# Altium schematic sheet Esquematico_2022-08-20.schdoc
size 297 x 182 mm
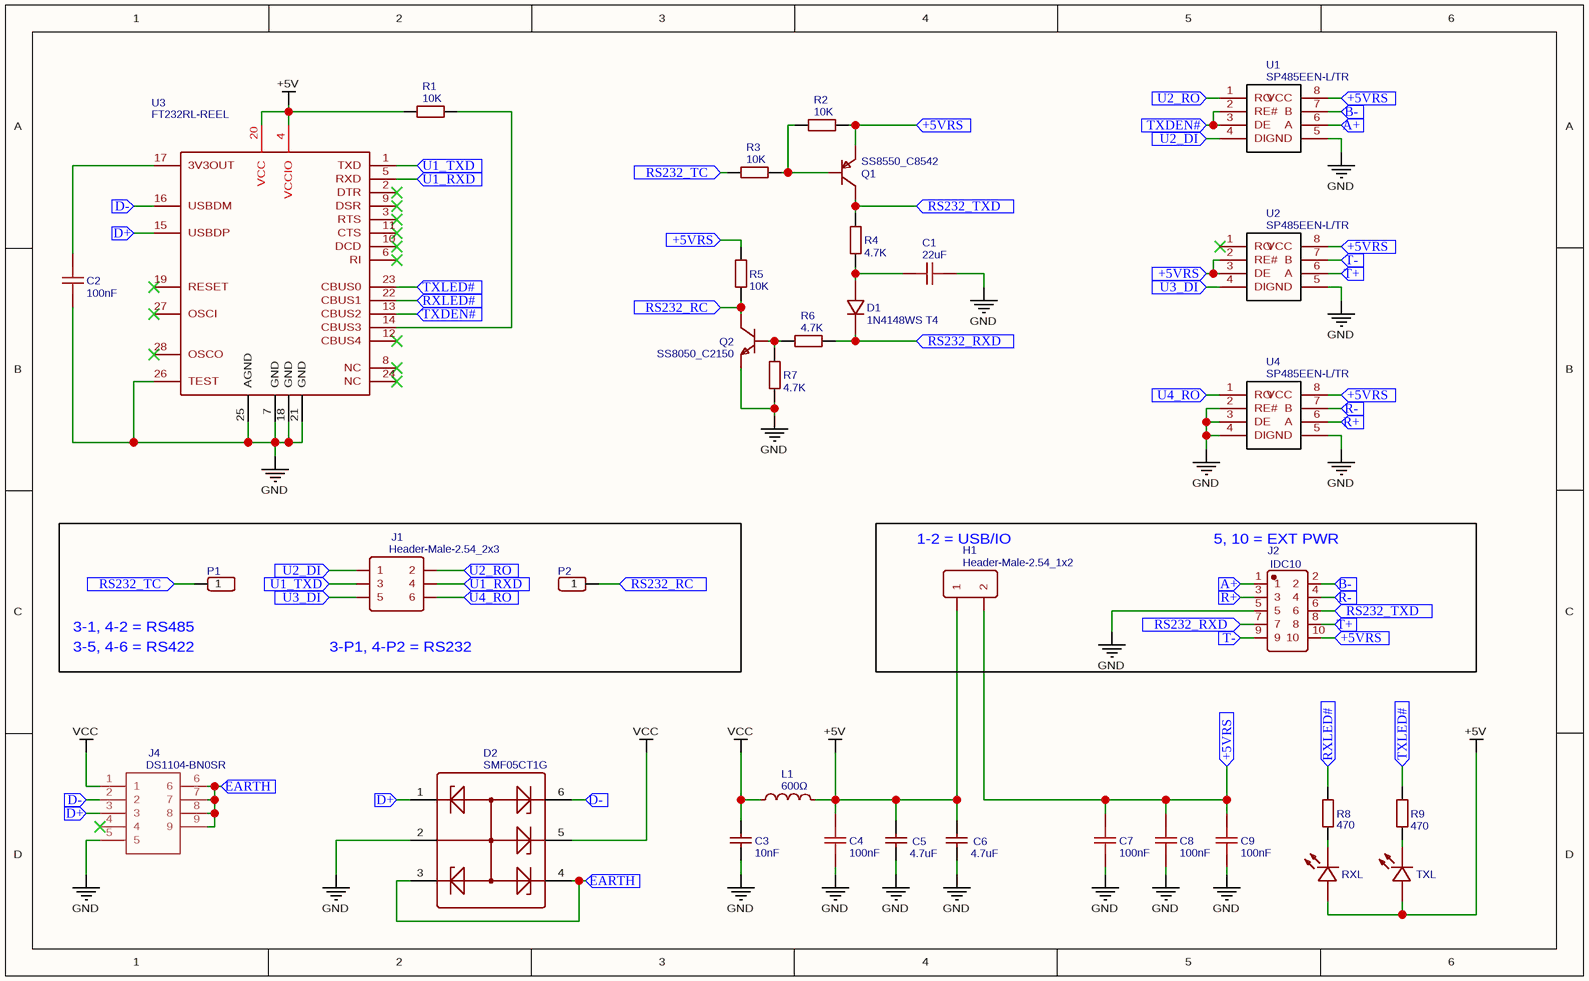
[diagram p0: Esquematico_2022-08-20.schdoc]

## Parts
C1  22uF  [C0805]
C2  100nF  [C0603]
C3  10nF  [C0603]
C4  100nF  [C0603]
C5  4.7uF  [C0603]
C6  4.7uF  [C0603]
C7  100nF  [C0603]
C8  100nF  [C0603]
C9  100nF  [C0603]
D1  1N4148WS T4  [SOD-323_L1.8-W1.3-LS2.5-RD]
D2  SMF05CT1G  [SOT-363_L2.0-W1.3-P0.65-LS2.1-TL]
H1  Header-Male-2.54_1x2  [HDR-TH_2P-P2.54-V]
J1  Header-Male-2.54_2x3  [HDR-TH_6P-P2.54-V-R2-C3-S2.54]
J2  IDC10  [IDC-TH_10P-P2.54-V-R2-C5-S2.54]
J4  DS1104-BN0SR  [DS1104BN0SR]
L1  600Ω  [L0805]
P1  Header-Male-2.54_1x1  [HDR-TH_1P-P2.54-V-M]  (value not drawn)
P2  Header-Male-2.54_1x1  [HDR-TH_1P-P2.54-V-M]  (value not drawn)
Q1  SS8550_C8542  [SOT-23-3_L2.9-W1.3-P1.90-LS2.4-BR]
Q2  SS8050_C2150  [SOT-23-3_L2.9-W1.3-P1.90-LS2.4-BR]
R1  10K  [R0603]
R2  10K  [R0603]
R3  10K  [R0603]
R4  4.7K  [R0603]
R5  10K  [R0603]
R6  4.7K  [R0603]
R7  4.7K  [R0603]
R8  470  [R0603]
R9  470  [R0603]
RXL  RXL  [LED0603-R-RD]  (value not drawn)
TXL  TXL  [LED0603-R-RD]  (value not drawn)
U1  SP485EEN-L/TR  [SOIC-8_L5.0-W4.0-P1.27-LS6.0-BL]
U2  SP485EEN-L/TR  [SOIC-8_L5.0-W4.0-P1.27-LS6.0-BL]
U3  FT232RL-REEL  [SSOP-28_L10.2-W5.3-P0.65-LS7.8-BL]
U4  SP485EEN-L/TR  [SOIC-8_L5.0-W4.0-P1.27-LS6.0-BL]

## Ports
+5VRS (in), A+ (in), B- (in), D+ (in), D- (in), EARTH (in), R+ (in), R- (in), RS232_RC (in), RS232_RXD (in), RS232_TC (in), RS232_TXD (in), RXLED# (in), T+ (in), T- (in), TXDEN# (in), TXLED# (in), U1_RXD (in), U1_TXD (in), U2_DI (in), U2_RO (in), U3_DI (in), U4_RO (in)

## Nets
+5V: C4.2 C5.2 C6.2 H1.1 L1.2 R1.1 RXL.1(A) TXL.1(A) U3.4(VCCIO) U3.20(VCC)
GND: C1.2 C2.1 C3.1 C4.1 C5.1 C6.1 C7.1 C8.1 C9.1 D2.2 J2.5 J4.5 Q2.2(E) R7.2 U1.5(GND) U2.5(GND) U3.7(GND) U3.18(GND) U3.21(GND) U3.25(AGND) U3.26(TEST) U4.2(RE#) U4.3(DE) U4.4(DI) U4.5(GND)
VCC: C3.2 D2.5 J4.1 L1.1
+5VRS: C7.2 C8.2 C9.2 H1.2 J2.10 Q1.2(E) R2.2 R5.2 U1.8(VCC) U2.2(RE#) U2.3(DE) U2.8(VCC) U4.8(VCC) ; port +5VRS
A+: J2.1 U1.6(A) ; port A+
B-: J2.2 U1.7(B) ; port B-
D+: D2.1 J4.3 U3.15(USBDP) ; port D+
D-: D2.6 J4.2 U3.16(USBDM) ; port D-
EARTH: D2.3 D2.4 J4.6 J4.7 J4.8 J4.9 ; port EARTH
R+: J2.3 U4.6(A) ; port R+
R-: J2.4 U4.7(B) ; port R-
RS232_RC: P2.1 Q2.3(C) R5.1 ; port RS232_RC
RS232_RXD: D1.1(K) J2.7 R6.1 ; port RS232_RXD
RS232_TC: P1.1 R3.1 ; port RS232_TC
RS232_TXD: J2.6 Q1.3(C) R4.2 ; port RS232_TXD
RXLED#: R8.2 U3.22(CBUS1) ; port RXLED#
T+: J2.8 U2.6(A) ; port T+
T-: J2.9 U2.7(B) ; port T-
TXDEN#: U1.2(RE#) U1.3(DE) U3.13(CBUS2) ; port TXDEN#
TXLED#: R9.1 U3.23(CBUS0) ; port TXLED#
U1_RXD: J1.4 U3.5(RXD) ; port U1_RXD
U1_TXD: J1.3 U3.1(TXD) ; port U1_TXD
U2_DI: J1.1 U1.4(DI) ; port U2_DI
U2_RO: J1.2 U1.1(RO) ; port U2_RO
U3_DI: J1.5 U2.4(DI) ; port U3_DI
U4_RO: J1.6 U4.1(RO) ; port U4_RO
NetC1_1: C1.1 D1.2(A) R4.1
NetC2_2: C2.2 U3.17(3V3OUT)
NetQ1_1: Q1.1(B) R2.1 R3.2
NetQ2_1: Q2.1(B) R6.2 R7.1
NetR1_2: R1.2 U3.14(CBUS3)
NetR8_1: R8.1 RXL.2(K)
NetR9_2: R9.2 TXL.2(K)

Not connected (* = marked no-connect by the designer): J4 4*; U2 1(RO)*; U3 2(DTR)* 3(RTS)* 6(RI)* 8(NC)* 9(DSR)* 10(DCD)* 11(CTS)* 12(CBUS4)* 19(RESET)* 24(NC)* 27(OSCI)* 28(OSCO)*

## Notes on the sheet
- (near H1) 1-2 = USB/IO
- (near J2) 5, 10 = EXT PWR
- (near P1) 3-1, 4-2 = RS485
- 3-5, 4-6 = RS422
- (near J1) 3-P1, 4-P2 = RS232

## Library data of the parts
C1 = 22uF: BOM_Manufacturer: SAMSUNG; BOM_Manufacturer Part: CL21A226MAQNNNE; nameAlias: Capacitance; SMT Type: Basic; BOM_Supplier: LCSC; BOM_Supplier Part: C45783; BOM_JLCPCB SMD: Yes; BOM_LCSC Assembly: Yes; spicePre: C; spiceSymbolName: CL21A226MAQNNNE
C2 C4 C7-C9 = 100nF: BOM_Manufacturer: YAGEO; BOM_Manufacturer Part: CC0603KRX7R9BB104; nameAlias: Capacitance; SMT Type: Basic; BOM_Supplier: LCSC; BOM_Supplier Part: C14663; BOM_JLCPCB SMD: Yes; BOM_LCSC Assembly: Yes; spicePre: C; spiceSymbolName: CC0603KRX7R9BB104
C3 = 10nF: BOM_Manufacturer: FH; BOM_Manufacturer Part: 0603B103K500NT; nameAlias: Capacitance; SMT Type: Basic; BOM_Supplier: LCSC; BOM_Supplier Part: C57112; BOM_JLCPCB SMD: Yes; BOM_LCSC Assembly: Yes; spicePre: C; spiceSymbolName: 0603B103K500NT
C5 C6 = 4.7uF: BOM_Manufacturer Part: CL10A475KO8NNNC; BOM_Manufacturer: SAMSUNG; nameAlias: Capacitance; SMT Type: Basic; BOM_Supplier: LCSC; BOM_Supplier Part: C19666; BOM_JLCPCB SMD: Yes; BOM_LCSC Assembly: Yes; spicePre: C; spiceSymbolName: CL10A475KO8NNNC
D1 = 1N4148WS T4: BOM_Manufacturer: CJ; SMT Type: Basic; BOM_Supplier: LCSC; BOM_Manufacturer Part: 1N4148WS T4; image: //image.lceda.cn/szlcsc/C2128.jpg; BOM_Supplier Part: C2128; BOM_JLCPCB SMD: Yes; BOM_LCSC Assembly: Yes; spicePre: D; spiceSymbolName: 1N4148WS T4
D2 = SMF05CT1G: BOM_Manufacturer: ON; SMT Type: Basic; BOM_Supplier: LCSC; BOM_Manufacturer Part: SMF05CT1G; image: //image.lceda.cn/szlcsc/C15879.jpg; BOM_Supplier Part: C15879; BOM_JLCPCB SMD: Yes; BOM_LCSC Assembly: Yes; spicePre: D; spiceSymbolName: SMF05CT1G
H1 = Header-Male-2.54_1x2: BOM_Manufacturer: TE Connectivity; BOM_Manufacturer Part: 826629-2; SMT Type: Extend; Package Display: No; BOM_Supplier: LCSC; image: //image.lceda.cn/szlcsc/C86471.jpg; BOM_Supplier Part: C86471; BOM_LCSC Assembly: Yes; spicePre: H; spiceSymbolName: Header-Male-2.54_1x2
J1 = Header-Male-2.54_2x3: BOM_Manufacturer: BOOMELE; SMT Type: Extend; Package Display: No; BOM_Supplier: LCSC; BOM_Manufacturer Part: Header-Male-2.54_2x3; BOM_Supplier Part: C65114; BOM_LCSC Assembly: Yes; spicePre: J; spiceSymbolName: Header-Male-2.54_2x3
J2 = IDC10: Contributor: romanlee; Package Display: No; spicePre: I; spiceSymbolName: IDC10
J4 = DS1104-BN0SR: Contributor: kutsiarda; Package Display: No; spicePre: J; spiceSymbolName: DS1104-BN0SR
L1 = 600Ω: BOM_Manufacturer: Sunlord; BOM_Manufacturer Part: GZ2012D601TF; nameAlias: Value; SMT Type: Basic; BOM_Supplier: LCSC; BOM_Supplier Part: C1017; BOM_JLCPCB SMD: Yes; BOM_LCSC Assembly: Yes; spicePre: L; spiceSymbolName: GZ2012D601TF
P1 P2 = Header-Male-2.54_1x1: BOM_Manufacturer: ReliaPro; SMT Type: Extend; Package Display: No; BOM_Supplier: LCSC; BOM_Manufacturer Part: Header-Male-2.54_1x1; BOM_Supplier Part: C81276; BOM_LCSC Assembly: Yes; spicePre: P; spiceSymbolName: Header-Male-2.54_1x1
Q1 = SS8550_C8542: BOM_Manufacturer: CJ; BOM_Manufacturer Part: SS8550; SMT Type: Basic; BOM_Supplier: LCSC; image: //image.lceda.cn/szlcsc/C8542.jpg; BOM_Supplier Part: C8542; BOM_JLCPCB SMD: Yes; BOM_LCSC Assembly: Yes; spicePre: Q; spiceSymbolName: SS8550_C8542
Q2 = SS8050_C2150: BOM_Manufacturer: CJ; BOM_Manufacturer Part: SS8050; SMT Type: Basic; BOM_Supplier: LCSC; image: //image.lceda.cn/szlcsc/C2150.jpg; BOM_Supplier Part: C2150; BOM_JLCPCB SMD: Yes; BOM_LCSC Assembly: Yes; spicePre: Q; spiceSymbolName: SS8050_C2150
R1-R3 R5 = 10K: BOM_Manufacturer: UniOhm; BOM_Manufacturer Part: 0603WAF1002T5E; nameAlias: Resistance (Ohms); SMT Type: Basic; BOM_Supplier: LCSC; BOM_Supplier Part: C25804; BOM_JLCPCB SMD: Yes; BOM_LCSC Assembly: Yes; spicePre: R; spiceSymbolName: 0603WAF1002T5E
R4 R6 R7 = 4.7K: BOM_Manufacturer: UniOhm; BOM_Manufacturer Part: 0603WAF4701T5E; nameAlias: Resistance (Ohms); SMT Type: Basic; BOM_Supplier: LCSC; BOM_Supplier Part: C23162; BOM_JLCPCB SMD: Yes; BOM_LCSC Assembly: Yes; spicePre: R; spiceSymbolName: 0603WAF4701T5E
R8 R9 = 470: BOM_Manufacturer: UniOhm; BOM_Manufacturer Part: 0603WAF4700T5E; nameAlias: Resistance (Ohms); SMT Type: Basic; BOM_Supplier: LCSC; BOM_Supplier Part: C23179; BOM_JLCPCB SMD: Yes; BOM_LCSC Assembly: Yes; spicePre: R; spiceSymbolName: 0603WAF4700T5E
RXL = RXL: BOM_Manufacturer: KENTO; BOM_Manufacturer Part: 0603White light; SMT Type: Basic; Package Display: No; BOM_Supplier: LCSC; image: //image.lceda.cn/szlcsc/C2290.jpg; BOM_Supplier Part: C2290; BOM_JLCPCB SMD: Yes; BOM_LCSC Assembly: Yes; spicePre: L; spiceSymbolName: 0603White light_C2290
TXL = TXL: BOM_Manufacturer: KENTO; BOM_Manufacturer Part: KT-0603R; SMT Type: Basic; Package Display: No; BOM_Supplier: LCSC; image: //image.lceda.cn/szlcsc/C2286.jpg; BOM_Supplier Part: C2286; BOM_JLCPCB SMD: Yes; BOM_LCSC Assembly: Yes; spicePre: L; spiceSymbolName: KT-0603R
U1 U2 U4 = SP485EEN-L/TR: BOM_Manufacturer: EXAR; SMT Type: Basic; BOM_Supplier: LCSC; BOM_Manufacturer Part: SP485EEN-L/TR; BOM_Supplier Part: C6855; BOM_JLCPCB SMD: Yes; BOM_LCSC Assembly: Yes; spicePre: U; spiceSymbolName: SP485EEN-L/TR
U3 = FT232RL-REEL: BOM_Manufacturer: FTDI; SMT Type: Basic; BOM_Supplier: LCSC; BOM_Manufacturer Part: FT232RL-REEL; image: //image.lceda.cn/szlcsc/C8690.jpg; BOM_Supplier Part: C8690; BOM_JLCPCB SMD: Yes; BOM_LCSC Assembly: Yes; spicePre: U; spiceSymbolName: FT232RL-REEL